# Altium schematic sheet 前级.SchDoc
size A1
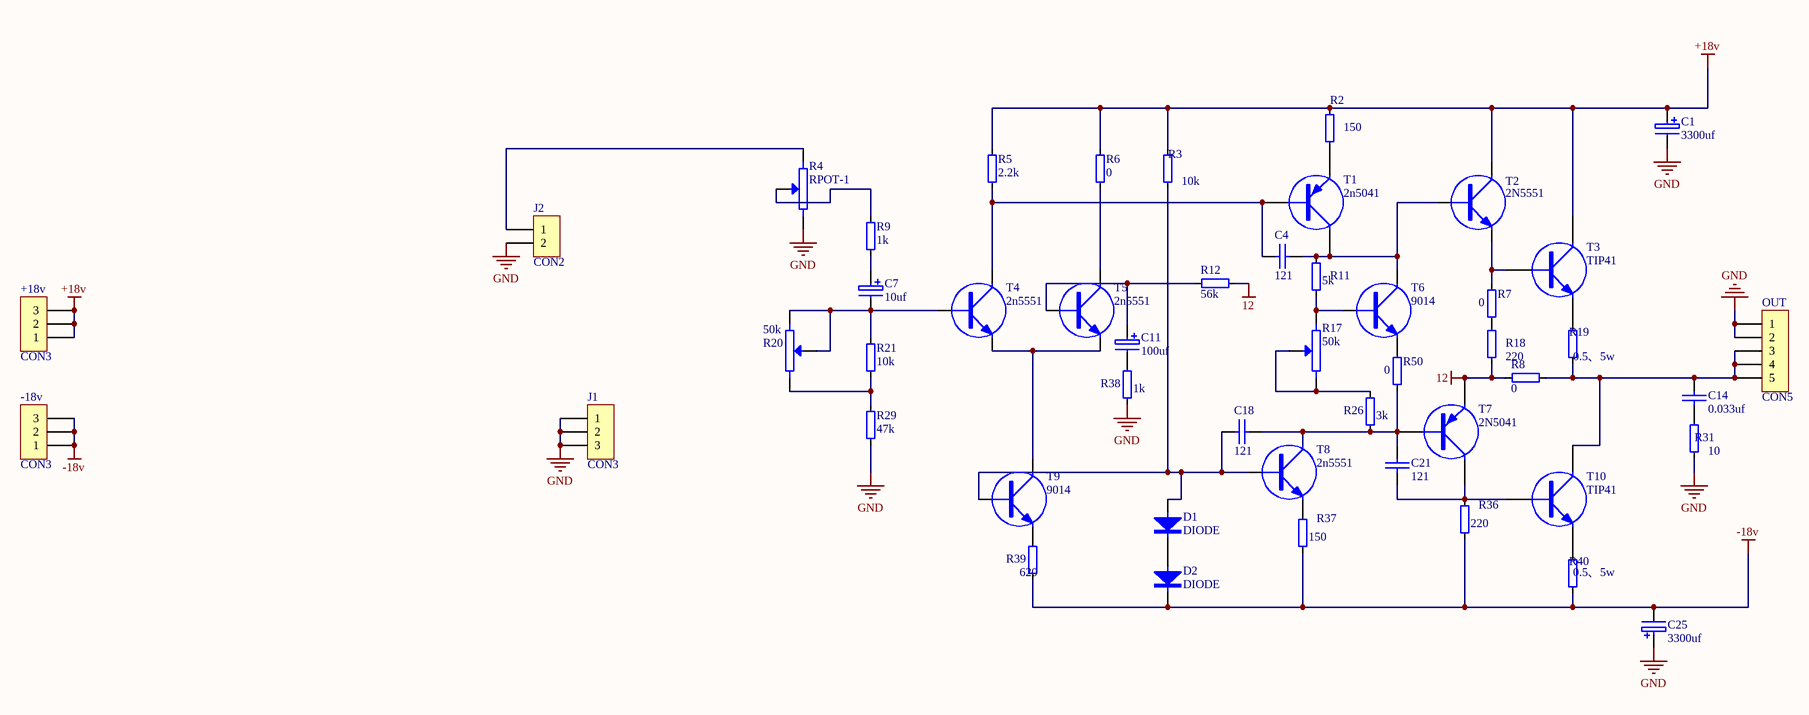
[diagram p0: 前级.SchDoc]

## Parts
+18v  CON3  [SIP-3]
-18v  CON3  [SIP-3]
C1  3300uf  [C14]
C4  121  [RAD0.1]
C7  10uf  [CAO1]
C11  100uf  [CAO1]
C14  0.033uf  [RAD0.1]
C18  121  [RAD0.1]
C21  121  [RAD0.1]
C25  3300uf  [C14]
D1  DIODE  [DIODE0.4]
D2  DIODE  [DIODE0.4]
J1  CON3  [SIP-3]
J2  CON2  [sip-2]
OUT  CON5  [SIP-5]
R2  150  [AXIAL0.4]
R3  10k  [AXIAL0.4]
R4  RPOT-1  [RVR-A]
R5  2.2k  [AXIAL0.4]
R6  0  [AXIAL0.4]
R7  0  [AXIAL0.4]
R8  0  [AXIAL0.4]
R9  1k  [AXIAL0.4]
R11  5k  [AXIAL0.4]
R12  56k  [AXIAL0.4]
R17  50k  [RVR-A]
R18  220  [AXIAL0.4]
R19  0.5、5w  [AXIAL0.4]
R20  50k  [RVR-A]
R21  10k  [AXIAL0.4]
R26  3k  [AXIAL0.4]
R29  47k  [AXIAL0.4]
R31  10  [AXIAL0.4]
R36  220  [AXIAL0.4]
R37  150  [AXIAL0.4]
R38  1k  [AXIAL0.4]
R39  620  [AXIAL0.4]
R40  0.5、5w  [AXIAL0.4]
R50  0  [AXIAL0.4]
T1  2n5041  [TO92B]
T2  2N5551  [TO92B]
T3  TIP41  [TO-220]
T4  2n5551  [TO92B]
T5  2n5551  [TO92B]
T6  9014  [TO92B]
T7  2N5041  [TO92B]
T8  2n5551  [TO92B]
T9  9014  [TO92B]
T10  TIP41  [TO-220]

## Nets
12: R8.1 R12.2 R18.2 T7.1(E)
+18v: +18v.1 +18v.2 +18v.3 C1.1 R2.1 R3.1 R5.1 R6.1 T2.3(C) T3.2(C)
-18v: -18v.1 -18v.2 -18v.3 C25.2 D2.2 R36.2 R37.2 R39.2 R40.2
GND: C1.2 C25.1 J1.1 J1.2 J1.3 J2.2 OUT.1 OUT.2 R4.1 R29.2 R31.2 R38.2
NetC4_1: C4.1 R5.2 T1.2(B) T4.3(C)
NetC4_2: C4.2 R11.1 T1.3(C) T2.2(B) T6.3(C)
NetC7_1: C7.1 R9.2
NetC7_2: C7.2 R20.1 R20.2(W) R21.1 T4.2(B)
NetC11_1: C11.1 R12.1 T5.2(B)
NetC11_2: C11.2 R38.1
NetC14_1: C14.1 R31.1
NetC14_2: C14.2 OUT.3 OUT.4 OUT.5 R8.2 R19.2 T10.2(C)
NetC18_1: C18.1 D1.1 R3.2 T8.2(B) T9.2(B)
NetC18_2: C18.2 C21.2 R26.2 R50.2 T7.2(B) T8.3(C)
NetC21_1: C21.1 R36.1 T7.3(C) T10.1(B)
NetD1_2: D1.2 D2.1
NetJ2_1: J2.1 R4.3
NetR2_2: R2.2 T1.1(E)
NetR4_2: R4.2(W) R9.1
NetR6_2: R6.2 T5.3(C)
NetR7_1: R7.1 T2.1(E) T3.1(B)
NetR7_2: R7.2 R18.1
NetR11_2: R11.2 R17.3 T6.2(B)
NetR17_1: R17.1 R17.2(W) R26.1
NetR19_1: R19.1 T3.3(E)
NetR20_3: R20.3 R21.2 R29.1
NetR37_1: R37.1 T8.1(E)
NetR39_1: R39.1 T9.1(E)
NetR40_1: R40.1 T10.3(E)
NetR50_1: R50.1 T6.1(E)
NetT4_1: T4.1(E) T5.1(E) T9.3(C)

## Library data of the parts
+18v -18v J1 = CON3: Connector
C1 C7 C11 C25 = CAP3
C4 C14 C18 C21 = CAP
J2 = CON2: Connector
OUT = CON5: Connector
R2 R3 R5-R9 R11 R12 R18 R19 R21 R26 R29 R31 R36-R40 R50 = RES
R4 R17 R20 = RPOT-1: Potentiometer
T1 T7 = 9012
T2 T4 T5 T8 = 9014
T3 T10 = TIP41: NPN PLASTIC POWER TRANSISTORS